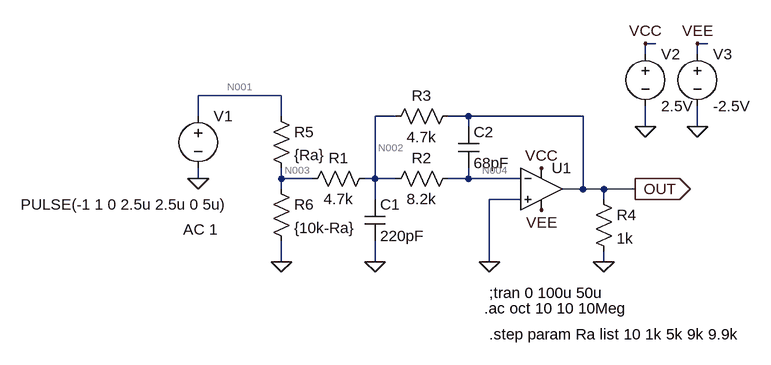
[diagram p0: schematic 2nd Multipule FeedBack with POT.asc]
2nd Multipule FeedBack with POT.asc, the LTspice schematic file:
Version 4
SHEET 1 880 680
WIRE 240 -64 224 -64
WIRE 320 -64 304 -64
WIRE 224 -48 224 -64
WIRE 304 -48 304 -64
WIRE -336 16 -464 16
WIRE -464 48 -464 16
WIRE -336 48 -336 16
WIRE -160 48 -192 48
WIRE -48 48 -80 48
WIRE 128 48 -48 48
WIRE -48 64 -48 48
WIRE 224 64 224 32
WIRE 304 64 304 32
WIRE -464 144 -464 128
WIRE -336 144 -336 128
WIRE -288 144 -336 144
WIRE -192 144 -192 48
WIRE -192 144 -208 144
WIRE -160 144 -192 144
WIRE -48 144 -48 128
WIRE -48 144 -80 144
WIRE 32 144 -48 144
WIRE -336 160 -336 144
WIRE 128 160 128 48
WIRE 128 160 96 160
WIRE 160 160 128 160
WIRE 208 160 160 160
WIRE -192 176 -192 144
WIRE 32 176 -16 176
WIRE 160 176 160 160
WIRE -336 272 -336 240
WIRE -192 272 -192 240
WIRE -16 272 -16 176
WIRE 160 272 160 256
FLAG -464 144 0
FLAG -192 272 0
FLAG -16 272 0
FLAG 224 64 0
FLAG 304 64 0
FLAG 224 -64 VCC
FLAG 304 -64 VEE
FLAG 64 128 VCC
FLAG 64 192 VEE
FLAG 160 272 0
FLAG 208 160 OUT
IOPIN 208 160 Out
FLAG -336 272 0
SYMBOL res -192 128 R90
WINDOW 0 0 56 VBottom 2
WINDOW 3 32 56 VTop 2
SYMATTR InstName R1
SYMATTR Value 4.7k
SYMBOL res -64 128 R90
WINDOW 0 0 56 VBottom 2
WINDOW 3 32 56 VTop 2
SYMATTR InstName R2
SYMATTR Value 8.2k
SYMBOL res -64 32 R90
WINDOW 0 0 56 VBottom 2
WINDOW 3 32 56 VTop 2
SYMATTR InstName R3
SYMATTR Value 4.7k
SYMBOL cap -208 176 R0
SYMATTR InstName C1
SYMATTR Value 220pF
SYMBOL cap -64 64 R0
SYMATTR InstName C2
SYMATTR Value 68pF
SYMBOL voltage -464 32 R0
WINDOW 3 -273 152 Left 2
WINDOW 123 -23 190 Left 2
WINDOW 39 0 0 Left 2
SYMATTR Value PULSE(-1 1 0 2.5u 2.5u 0 5u)
SYMATTR Value2 AC 1
SYMATTR InstName V1
SYMBOL voltage 224 -64 R0
WINDOW 123 0 0 Left 2
WINDOW 39 0 0 Left 2
SYMATTR InstName V2
SYMATTR Value 2.5V
SYMBOL voltage 304 -64 R0
WINDOW 123 0 0 Left 2
WINDOW 39 0 0 Left 2
SYMATTR InstName V3
SYMATTR Value -2.5V
SYMBOL Opamps\\UniversalOpamp2 64 160 R0
SYMATTR InstName U1
SYMBOL res 144 160 R0
SYMATTR InstName R4
SYMATTR Value 1k
SYMBOL res -352 32 R0
SYMATTR InstName R5
SYMATTR Value {Ra}
SYMBOL res -352 144 R0
SYMATTR InstName R6
SYMATTR Value {10k-Ra}
TEXT -16 320 Left 2 !;tran 0 100u 50u
TEXT -24 344 Left 2 !.ac oct 10 10 10Meg
TEXT -16 384 Left 2 !.step param Ra list 10 1k 5k 9k 9.9k

The netlist it stands for:
* 2nd Multipule FeedBack with POT.asc
R1 N002 N003 4.7k
R2 N004 N002 8.2k
R3 OUT N002 4.7k
C1 N002 0 220pF
C2 OUT N004 68pF
V1 N001 0 PULSE(-1 1 0 2.5u 2.5u 0 5u) AC 1
V2 VCC 0 2.5V
V3 VEE 0 -2.5V
XU1 0 N004 VCC VEE OUT level.2 Avol=1Meg GBW=10Meg Slew=10Meg ilimit=25m rail=0 Vos=0 phimargin=45 en=0 enk=0 in=0 ink=0 Rin=500Meg  ; pins IN+ IN- V+ V- OUT
R4 OUT 0 1k
R5 N001 N003 {Ra}
R6 N003 0 {10k-Ra}
;tran 0 100u 50u
.ac oct 10 10 10Meg
.step param Ra list 10 1k 5k 9k 9.9k
.lib UniversalOpamps2.sub
.backanno
.end

* Results of the author's LTspice run, read from the files saved beside the schematic
* Operating Point (first step), zero values left out:
*   ra = 10 
*   V(n002) = -1.049 µV
*   V(n003) = -996.9 mV
*   V(n004) = -1.049 µV
*   V(out) = 996.9 mV
*   V(n001) = -1 V
*   V(vcc) = 2.5 V
*   V(vee) = -2.5 V
*   I(R6) = -99.79 µA
*   I(R5) = -311.9 µA
*   I(R4) = 996.9 µA
*   I(R3) = 212.1 µA
*   I(R1) = 212.1 µA
*   I(V3) = 42.01 µA
*   I(V2) = -1.251 mA
*   I(V1) = 311.9 µA
*   Ix(u1:3) = 1.251 mA
*   Ix(u1:4) = -42.01 µA
*   Ix(u1:5) = -1.209 mA
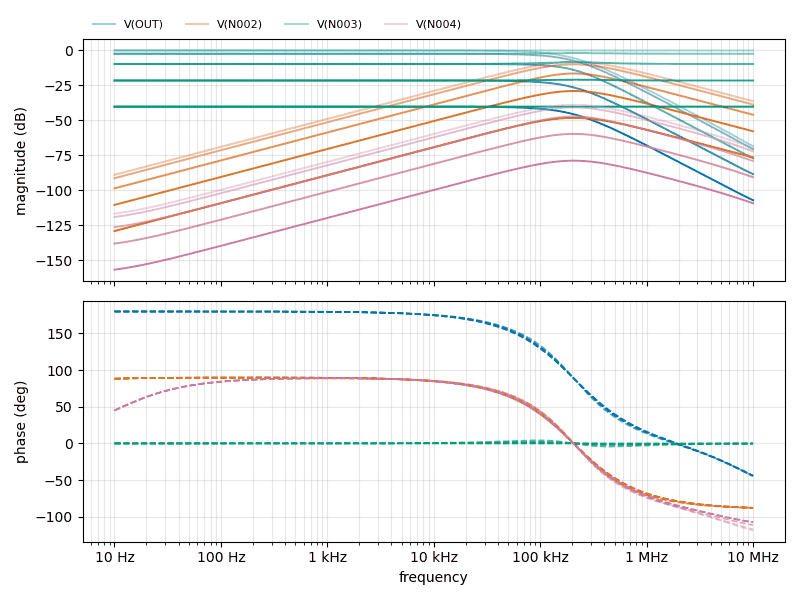
[diagram p1: AC Analysis of 2nd Multipule FeedBack with POT.asc, plotted from the saved traces]
* AC Analysis, 5 runs:
*   V(OUT) [run 1]: -0.03 dB at 10 Hz, -68.48 dB at 10 MHz, peak -0.03 dB at 10 Hz, 3 dB below the peak at 144.7 kHz
*   V(OUT) [run 2]: -2.44 dB at 10 Hz, -70.62 dB at 10 MHz, peak -2.44 dB at 10 Hz, 3 dB below the peak at 158.2 kHz
*   V(OUT) [run 3]: -9.73 dB at 10 Hz, -77.10 dB at 10 MHz, peak -9.73 dB at 10 Hz, 3 dB below the peak at 176.4 kHz
*   V(OUT) [run 4]: -21.52 dB at 10 Hz, -88.42 dB at 10 MHz, peak -21.52 dB at 10 Hz, 3 dB below the peak at 158.2 kHz
*   V(OUT) [run 5]: -40.18 dB at 10 Hz, -107.03 dB at 10 MHz, peak -40.18 dB at 10 Hz, 3 dB below the peak at 146.2 kHz
*   V(N002) [run 1]: -88.88 dB at 10 Hz, -36.29 dB at 10 MHz, peak -8.08 dB at 201.7 kHz, 3 dB below the peak at 89.22 kHz and 477.8 kHz
*   V(N002) [run 2]: -91.29 dB at 10 Hz, -38.70 dB at 10 MHz, peak -9.93 dB at 201.7 kHz, 3 dB below the peak at 93.19 kHz and 457.5 kHz
*   V(N002) [run 3]: -98.57 dB at 10 Hz, -45.98 dB at 10 MHz, peak -16.50 dB at 201.7 kHz, 3 dB below the peak at 98.26 kHz and 433.9 kHz
*   V(N002) [run 4]: -110.37 dB at 10 Hz, -57.78 dB at 10 MHz, peak -29.01 dB at 201.7 kHz, 3 dB below the peak at 93.17 kHz and 457.4 kHz
*   V(N002) [run 5]: -129.03 dB at 10 Hz, -76.44 dB at 10 MHz, peak -48.17 dB at 201.7 kHz, 3 dB below the peak at 89.66 kHz and 475.4 kHz
*   V(N003) [run 1]: -0.03 dB at 10 Hz, -0.03 dB at 10 MHz, peak -0.02 dB at 201.7 kHz
*   V(N003) [run 2]: -2.44 dB at 10 Hz, -2.44 dB at 10 MHz, peak -1.87 dB at 201.7 kHz
*   V(N003) [run 3]: -9.73 dB at 10 Hz, -9.72 dB at 10 MHz, peak -8.44 dB at 201.7 kHz
*   V(N003) [run 4]: -21.52 dB at 10 Hz, -21.52 dB at 10 MHz, peak -20.95 dB at 201.7 kHz
*   V(N003) [run 5]: -40.18 dB at 10 Hz, -40.18 dB at 10 MHz, peak -40.11 dB at 201.7 kHz
*   V(N004) [run 1]: -116.62 dB at 10 Hz, -69.85 dB at 10 MHz, peak -38.83 dB at 201.7 kHz, 3 dB below the peak at 89.2 kHz and 477.3 kHz
*   V(N004) [run 2]: -119.03 dB at 10 Hz, -72.17 dB at 10 MHz, peak -40.68 dB at 201.7 kHz, 3 dB below the peak at 93.17 kHz and 457 kHz
*   V(N004) [run 3]: -126.24 dB at 10 Hz, -79.08 dB at 10 MHz, peak -47.18 dB at 201.7 kHz, 3 dB below the peak at 98.25 kHz and 433.6 kHz
*   V(N004) [run 4]: -137.98 dB at 10 Hz, -90.58 dB at 10 MHz, peak -59.62 dB at 201.7 kHz, 3 dB below the peak at 93.16 kHz and 457 kHz
*   V(N004) [run 5]: -156.63 dB at 10 Hz, -109.21 dB at 10 MHz, peak -78.78 dB at 201.7 kHz, 3 dB below the peak at 89.64 kHz and 474.9 kHz